# EAGLE design Main_Board_Kukang_EV (EAGLE 9.6.2)
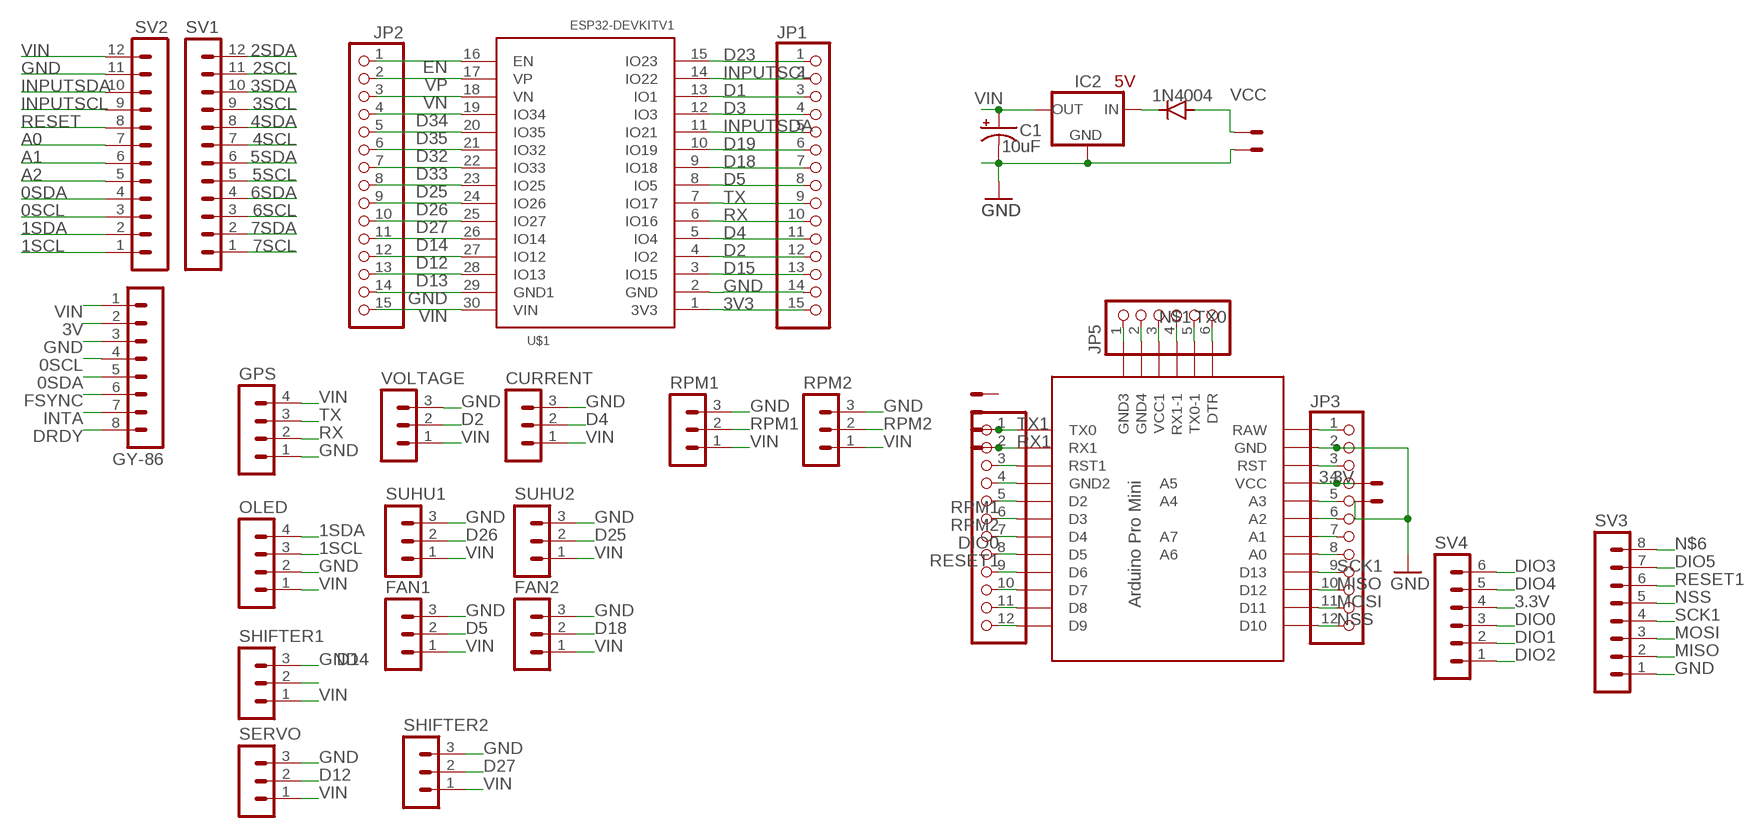
[diagram p0: schematic, sheet 1]

## Parts
C1  10uF  CPOL-USE5-10.5  [E5-10,5]
CURRENT  MA03-1  [MA03-1]
D1  1N4004  [DO41-10]
ESC_BOARD  22-23-2021  [22-23-2021]
FAN1  MA03-1  [MA03-1]
FAN2  MA03-1  [MA03-1]
GPS  MA04-1  [MA04-1]
GY-86  MA08-1  [MA08-1]
IC2  V_REG_78XX  [V78W_BACKWARDS]
JP1  PINHD-1X15  [1X15]
JP2  PINHD-1X15  [1X15]
JP3  PINHD-1X12  [1X12]
JP4  PINHD-1X12  [1X12]
JP5  PINHD-1X6  [1X06]
OLED  MA04-1  [MA04-1]
POWET  22-23-2021  [22-23-2021]
RPM1  MA03-1  [MA03-1]
RPM2  MA03-1  [MA03-1]
SERVO  MA03-1  [MA03-1]
SHIFTER1  MA03-1  [MA03-1]
SHIFTER2  MA03-1  [MA03-1]
SUHU1  MA03-1  [MA03-1]
SUHU2  MA03-1  [MA03-1]
SV1  MA12-1  [MA12-1]
SV2  MA12-1  [MA12-1]
SV3  MA08-1  [MA08-1]
SV4  MA06-1  [MA06-1]
U$1  ESP32DEVKITV1  [ESP32-DEVKITV1]
U$2  PRO-MINI-2  [PRO-MINI-2]
UART_MAIN_BOARD  22-23-2021  [22-23-2021]
VBAT  22-23-2021  [22-23-2021]
VOLTAGE  MA03-1  [MA03-1]

## Nets
0SCL: GY-86.4 SV2.3
0SDA: GY-86.5 SV2.4
1SCL: OLED.3 SV2.1
1SDA: OLED.4 SV2.2
2SCL: SV1.11
2SDA: SV1.12
3.3V: JP3.4 POWET.1 SV4.4 U$2.VCC
3SCL: SV1.9
3SDA: SV1.10
3V: GY-86.2
3V3: JP1.15 U$1.1(3V3)
4SCL: SV1.7
4SDA: SV1.8
5SCL: SV1.5
5SDA: SV1.6
6SCL: SV1.3
6SDA: SV1.4
7SCL: SV1.1
7SDA: SV1.2
A0: SV2.7
A1: SV2.6
A2: SV2.5
D1: JP1.3 U$1.13(IO1)
D2: JP1.12 U$1.4(IO2) VOLTAGE.2
D3: JP1.4 U$1.12(IO3)
D4: CURRENT.2 JP1.11 U$1.5(IO4)
D5: FAN1.2 JP1.8 U$1.8(IO5)
D12: JP2.12 SERVO.2 U$1.27(IO12)
D13: JP2.13 U$1.28(IO13)
D14: JP2.11 SHIFTER1.2 U$1.26(IO14)
D15: JP1.13 U$1.3(IO15)
D18: FAN2.2 JP1.7 U$1.9(IO18)
D19: JP1.6 U$1.10(IO19)
D23: JP1.1 U$1.15(IO23)
D25: JP2.8 SUHU2.2 U$1.23(IO25)
D26: JP2.9 SUHU1.2 U$1.24(IO26)
D27: JP2.10 SHIFTER2.2 U$1.25(IO27)
D32: JP2.6 U$1.21(IO32)
D33: JP2.7 U$1.22(IO33)
D34: JP2.4 U$1.19(IO34)
D35: JP2.5 U$1.20(IO35)
DIO0: JP4.7 SV4.3 U$2.D4
DIO1: JP4.9 SV4.2 U$2.D6
DIO2: SV4.1
DIO3: SV4.6
DIO4: SV4.5
DIO5: SV3.7
DRDY: GY-86.8
EN: JP2.1 U$1.16(EN)
FSYNC: GY-86.6
GND: C1.- CURRENT.3 FAN1.3 FAN2.3 GPS.1 GY-86.3 IC2.GND JP1.14 JP2.14 JP3.2 OLED.2 POWET.2 RPM1.3 RPM2.3 SERVO.3 SHIFTER1.3 SHIFTER2.3 SUHU1.3 SUHU2.3 SV2.11 SV3.1 U$1.2(GND) U$1.29(GND1) U$2.GND VBAT.2 VOLTAGE.3
INPUTSCL: JP1.2 SV2.9 U$1.14(IO22)
INPUTSDA: JP1.5 SV2.10 U$1.11(IO21)
INTA: GY-86.7
MISO: JP3.10 SV3.2 U$2.D12
MOSI: JP3.11 SV3.3 U$2.D11
N$1: JP5.3 U$2.VCC1
N$2: JP3.8 U$2.A0
N$3: JP3.7 U$2.A1
N$4: D1.C IC2.IN
N$5: JP3.6 U$2.A2
N$6: SV3.8
N$7: JP3.5 U$2.A3
N$8: JP3.3 U$2.RST
N$9: JP3.1 U$2.RAW
N$10: JP4.3 U$2.RST1
N$11: JP4.4 U$2.GND1(GND2)
N$14: JP4.10 U$2.D7
N$15: JP4.11 U$2.D8
N$16: JP4.12 U$2.D9
N$17: JP5.6 U$2.DTR
N$18: JP5.2 U$2.GND3(GND4)
N$19: JP5.1 U$2.GND2(GND3)
NSS: JP3.12 SV3.5 U$2.D10
RESET: SV2.8
RESET1: JP4.8 SV3.6 U$2.D5
RPM1: JP4.5 RPM1.2 U$2.D2
RPM2: JP4.6 RPM2.2 U$2.D3
RX: GPS.2 JP1.10 U$1.6(IO16)
RX0: JP5.4 U$2.RX1-1
RX1: JP4.2 U$2.RX1 UART_MAIN_BOARD.2
SCK1: JP3.9 SV3.4 U$2.D13
TX: GPS.3 JP1.9 U$1.7(IO17)
TX0: JP5.5 U$2.TX0-1
TX1: JP4.1 U$2.TX0 UART_MAIN_BOARD.1
VCC: D1.A VBAT.1
VIN: C1.+ CURRENT.1 FAN1.1 FAN2.1 GPS.4 GY-86.1 IC2.OUT JP2.15 OLED.1 RPM1.1 RPM2.1 SERVO.1 SHIFTER1.1 SHIFTER2.1 SUHU1.1 SUHU2.1 SV2.12 U$1.30(VIN) VOLTAGE.1
VN: JP2.3 U$1.18(VN)
VP: JP2.2 U$1.17(VP)
Unconnected: ESC_BOARD.1 ESC_BOARD.2 U$2.A4 U$2.A5 U$2.A6 U$2.A7

## Notes on the sheet
- 5V

## Library data of the parts
C1 = rcl:CPOL-US: POLARIZED CAPACITOR, American symbol; SPICEPREFIX: C
CURRENT FAN1 FAN2 RPM1 RPM2 SERVO SHIFTER1 SHIFTER2 SUHU1 SUHU2 VOLTAGE = con-lstb:MA03-1: PIN HEADER; OC_FARNELL: unknown; OC_NEWARK: unknown
D1 = diode:1N4004: DIODE general purpose rectifier, 1 A
ESC_BOARD POWET UART_MAIN_BOARD VBAT = con-molex:22-23-2021: .100" (2.54mm) Center Header - 2 Pin; MF: MOLEX; MPN: 22-23-2021; OC_FARNELL: 1462926; OC_NEWARK: 25C3832
GPS OLED = con-lstb:MA04-1: PIN HEADER; OC_FARNELL: unknown; OC_NEWARK: unknown
GY-86 SV3 = con-lstb:MA08-1: PIN HEADER; OC_FARNELL: unknown; OC_NEWARK: unknown
IC2 = 2018:V_REG_78XX: Voltage Regulator Standard 7805 5V regulator. IGO (Input Ground Output). Spark Fun Electronics SKU : COM-00107
JP1 JP2 = pinhead:PINHD-1X15: PIN HEADER
JP3 JP4 = pinhead:PINHD-1X12: PIN HEADER
JP5 = pinhead:PINHD-1X6: PIN HEADER
SV1 SV2 = con-lstb:MA12-1: PIN HEADER; OC_FARNELL: unknown; OC_NEWARK: unknown
SV4 = con-lstb:MA06-1: PIN HEADER; OC_FARNELL: unknown; OC_NEWARK: unknown
U$1 = ESP32-DEVKITV1:ESP32DEVKITV1
U$2 = Arduino-clone:PRO-MINI-2: Arduino Pro Mini Layout 2 Sparkfun.com

## Board
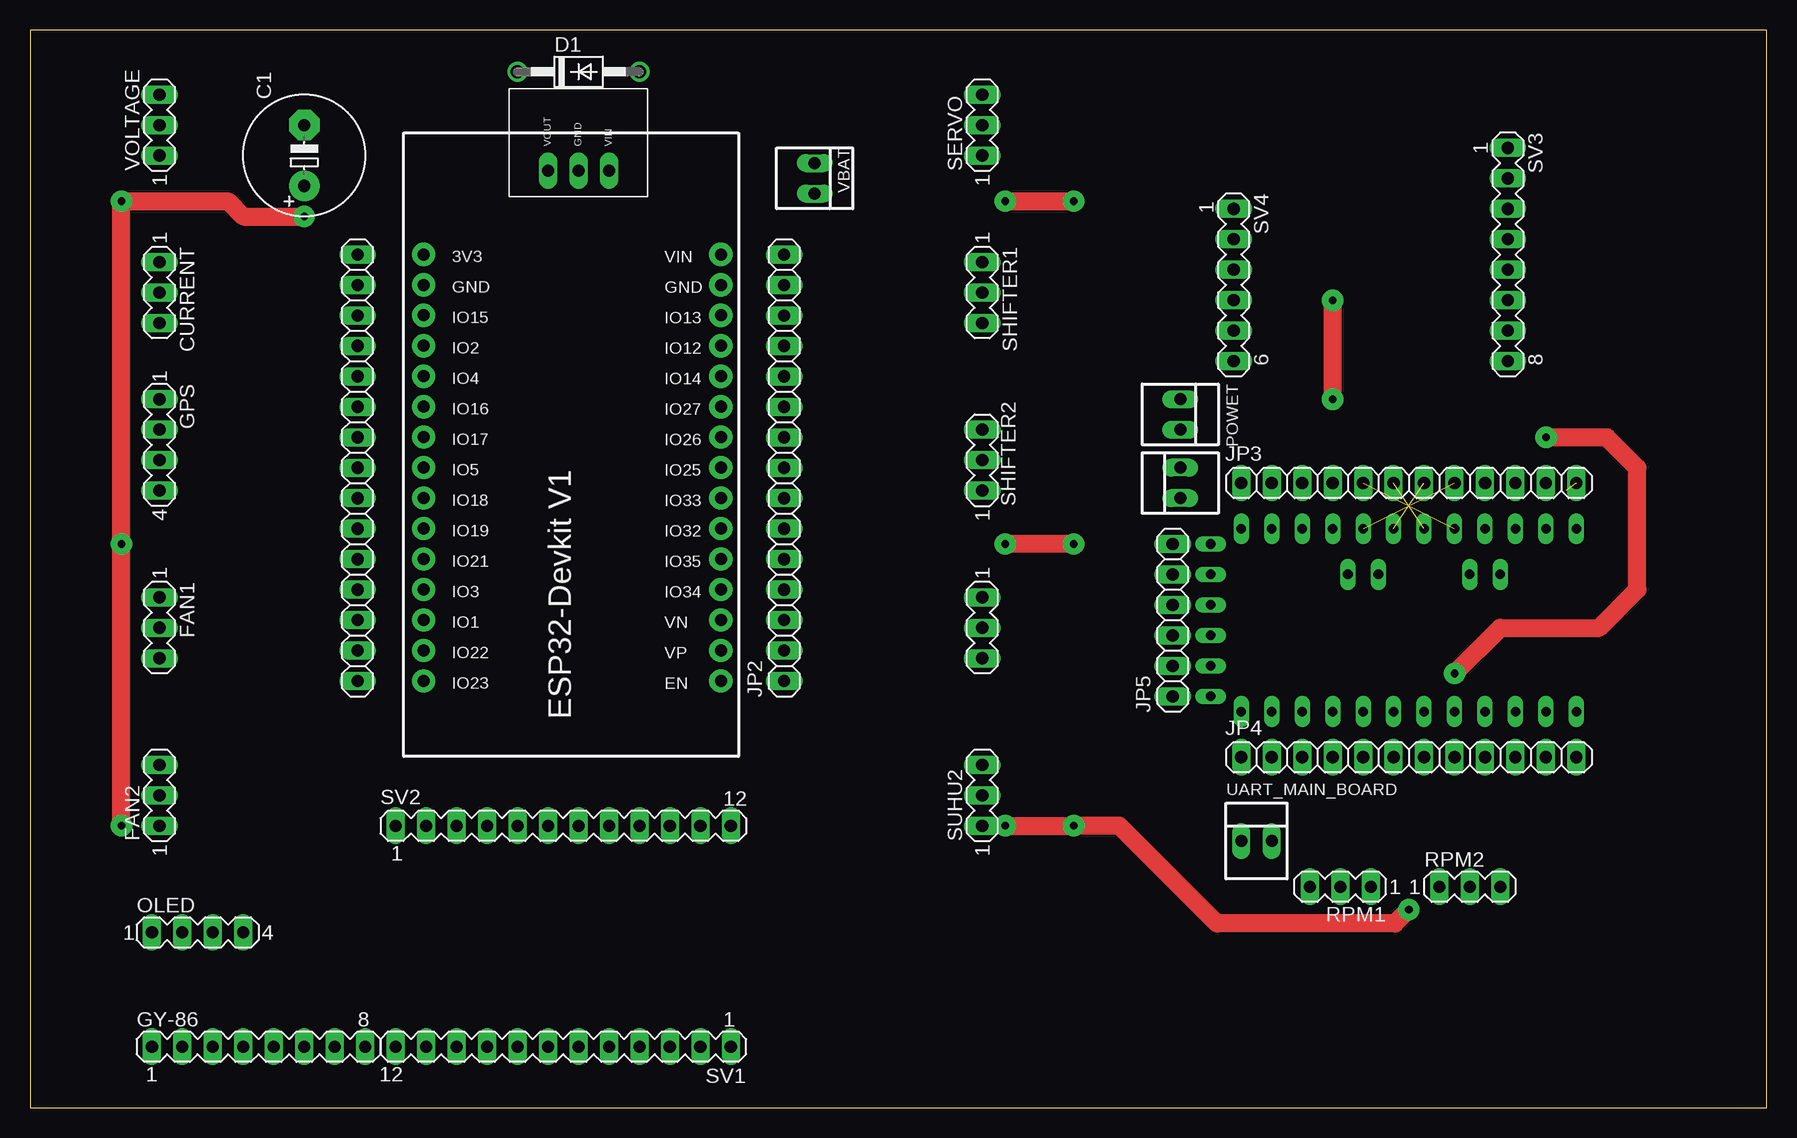
[diagram p1: board, top side]
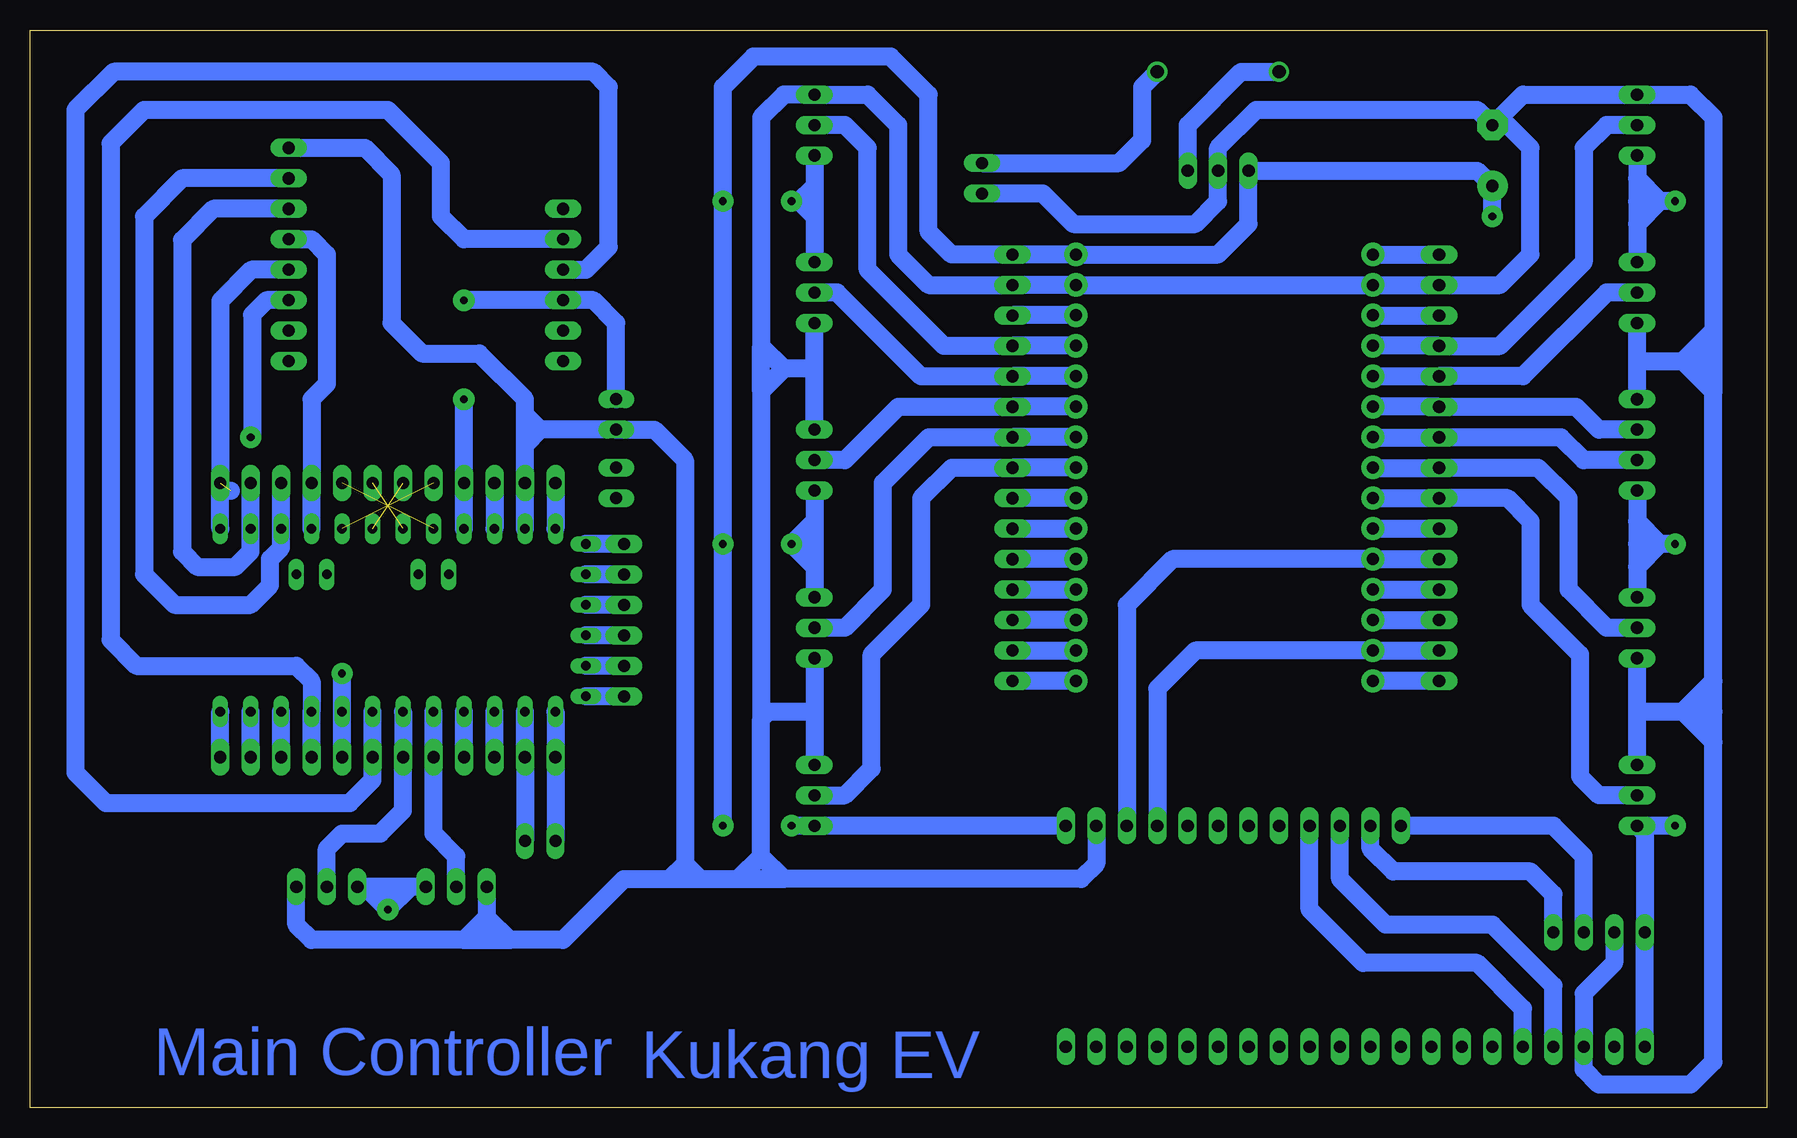
[diagram p2: board, bottom side, seen from below]

Size 144.76 x 89.84 mm. Coordinates in mm from the lower left corner, seen from the top.
Outline: 0,0 144.76,0 144.76,89.84 0,89.84 0,0
Copper layers (1*16): Top 0.035mm / dielectric 1.5mm / Bottom 0.035mm
Design rules "default": minimum track width 6mil, minimum drill 0.35mm, track to track 6mil, track to pad 6mil, pad to pad 6mil, via to via 6mil, smd to smd 6mil, copper to edge 40mil, drill to drill 6mil, minimum pad ring 10mil, minimum via ring 8mil, stop-mask expansion 4mil, vias tented up to drill 0mil, thermal gap 10mil

### Footprints (pad centres in the part's own frame; a part is rotated, then mirrored left to right if it is on the bottom)
E5-10,5 = drill 1.016 pad 2.54: + -2.54,0 | drill 1.016 pad 2.54 octagon: - 2.54,0
MA03-1 = drill 1.016 long: 1 -2.54,0; 2 0,0; 3 2.54,0
DO41-10 = drill 1.118: A 5.08,0; C -5.08,0
22-23-2021 = drill 1 long: 1 -1.27,0; 2 1.27,0
MA04-1 = drill 1.016 long: 1 -3.81,0; 2 -1.27,0; 3 1.27,0; 4 3.81,0
MA08-1 = drill 1.016 long: 1 -8.89,0; 2 -6.35,0; 3 -3.81,0; 4 -1.27,0; 5 1.27,0; 6 3.81,0; 7 6.35,0; 8 8.89,0
V78W_BACKWARDS = drill 1.016 long: GND 0,-3.81; IN 2.54,-3.81; OUT -2.54,-3.81
1X15 = drill 1.016 long: 1 -17.78,0; 2 -15.24,0; 3 -12.7,0; 4 -10.16,0; 5 -7.62,0; 6 -5.08,0; 7 -2.54,0; 8 0,0; 9 2.54,0; 10 5.08,0; 11 7.62,0; 12 10.16,0; 13 12.7,0; 14 15.24,0; 15 17.78,0
1X12 = drill 1.016 long: 1 -13.97,0; 2 -11.43,0; 3 -8.89,0; 4 -6.35,0; 5 -3.81,0; 6 -1.27,0; 7 1.27,0; 8 3.81,0; 9 6.35,0; 10 8.89,0; 11 11.43,0; 12 13.97,0
1X06 = drill 1.016 long: 1 -6.35,0; 2 -3.81,0; 3 -1.27,0; 4 1.27,0; 5 3.81,0; 6 6.35,0
MA12-1 = drill 1.016 long: 1 -13.97,0; 2 -11.43,0; 3 -8.89,0; 4 -6.35,0; 5 -3.81,0; 6 -1.27,0; 7 1.27,0; 8 3.81,0; 9 6.35,0; 10 8.89,0; 11 11.43,0; 12 13.97,0
MA06-1 = drill 1.016 long: 1 -6.35,0; 2 -3.81,0; 3 -1.27,0; 4 1.27,0; 5 3.81,0; 6 6.35,0
ESP32-DEVKITV1 = drill 1 pad 1.93: 1 -22.87,-13.54; 2 -20.33,-13.54; 3 -17.79,-13.54; 4 -15.25,-13.54; 5 -12.71,-13.54; 6 -10.17,-13.54; 7 -7.63,-13.54; 8 -5.09,-13.54; 9 -2.55,-13.54; 10 -0.01,-13.54; 11 2.53,-13.54; 12 5.07,-13.54; 13 7.61,-13.54; 14 10.15,-13.54; 15 12.69,-13.54; 16 12.69,11.23; 17 10.15,11.23; 18 7.61,11.23; 19 5.07,11.23; 20 2.53,11.23; 21 -0.01,11.23; 22 -2.55,11.23; 23 -5.09,11.23; 24 -7.63,11.23; 25 -10.17,11.23; 26 -12.71,11.23; 27 -15.25,11.23; 28 -17.79,11.23; 29 -20.33,11.23; 30 -22.87,11.23
PRO-MINI-2 = drill 0.8 long: A0 6.35,2.54; A1 6.35,0; A2 6.35,-2.54; A3 6.35,-5.08; A4 2.54,1.27; A5 2.54,3.81; A6 2.54,-8.89; A7 2.54,-6.35; D2 -8.89,2.54; D3 -8.89,0; D4 -8.89,-2.54; D5 -8.89,-5.08; D6 -8.89,-7.62; D7 -8.89,-10.16; D8 -8.89,-12.7; D9 -8.89,-15.24; D10 6.35,-15.24; D11 6.35,-12.7; D12 6.35,-10.16; D13 6.35,-7.62; DTR 5.08,15.24; GND 6.35,10.16; GND1 -8.89,5.08; GND2 -7.62,15.24; GND3 -5.08,15.24; RAW 6.35,12.7; RST 6.35,7.62; RST1 -8.89,7.62; RX1 -8.89,10.16; RX1-1 0,15.24; TX0 -8.89,12.7; TX0-1 2.54,15.24; VCC 6.35,5.08; VCC1 -2.54,15.24

### Placement (x,y rotation side)
C1  22.86,79.38 90 top
CURRENT  10.79,67.95 270 top
D1  45.72,86.36 0 top
ESC_BOARD  95.89,52.07 90 top
FAN1  10.79,40 270 top
FAN2  10.79,26.03 90 top
GPS  10.79,55.24 270 top
GY-86  19.05,5.08 0 top
IC2  45.72,81.92 0 top
JP1  27.3,53.34 90 top
JP2  62.87,53.34 90 top
JP3  114.94,52.07 0 top
JP4  114.94,29.21 0 top
JP5  95.25,40.64 90 top
OLED  13.97,14.6 0 top
POWET  95.89,57.79 270 top
RPM1  109.22,18.41 180 top
RPM2  120.02,18.41 0 top
SERVO  79.38,81.92 90 top
SHIFTER1  79.38,67.95 270 top
SHIFTER2  79.38,53.97 90 top
SUHU1  79.38,40 270 top
SUHU2  79.38,26.03 90 top
SV1  44.45,5.08 180 top
SV2  44.45,23.49 0 top
SV3  123.19,71.12 270 top
SV4  100.33,68.58 270 top
U$1  46.35,48.26 270 top
U$2  113.67,41.91 90 top
UART_MAIN_BOARD  102.23,22.23 0 top
VBAT  65.41,77.47 270 top
VOLTAGE  10.79,81.92 90 top

### Tracks (layer width: path | path; a pad name or v marks a point on that pad's centre or on a via)
0SCL
  Bottom 1.5: GY-86.4 17.78,10.16 22.86,15.24 31.75,15.24 35.56,19.05 SV2.3
0SDA
  Bottom 1.5: GY-86.5 20.32,8.26 24.13,12.06 33.66,12.06 38.1,16.51 SV2.4
1SCL
  Bottom 1.5: OLED.3 15.24,20.95 17.78,23.49 SV2.1
1SDA
  Bottom 1.5: OLED.4 17.78,17.78 19.68,19.69 31.11,19.69 33.02,21.59 SV2.2
3.3V  (via drill 0.64 pad 1.78)
  Top 1.5: v108.58,59.05 v108.58,67.31
  Bottom 1.5: U$2.VCC JP3.4 v108.58,59.05 | v108.58,67.31 SV4.4 97.79,67.31 95.89,65.41 POWET.1
3V3
  Bottom 1.5: U$1.1 32.8,71.12 JP1.15
D1
  Bottom 1.5: U$1.13 32.8,40.64 JP1.3
D2
  Bottom 1.5: U$1.4 27.32,63.51 JP1.12 22.23,63.5 15.24,70.48 15.24,80.01 13.34,81.92 VOLTAGE.2
D3
  Bottom 1.5: U$1.12 32.8,43.18 JP1.4
D4
  Bottom 1.5: U$1.5 27.32,60.97 | 27.32,60.97 JP1.11 | CURRENT.2 13.34,67.95 20.31,60.97 27.32,60.97
D5
  Bottom 1.5: U$1.8 32.8,53.34 JP1.8 19.05,53.34 16.51,50.8 16.51,43.18 13.34,40 FAN1.2
D12
  Bottom 1.5: U$1.27 62.85,63.51 JP2.12 68.58,63.5 74.93,69.85 74.93,80.01 76.83,81.92 SERVO.2
D13
  Bottom 1.5: U$1.28 62.85,66.05 JP2.13
D14
  Bottom 1.5: U$1.26 62.85,60.97 JP2.11 70.48,60.96 77.47,67.95 SHIFTER1.2
D15
  Bottom 1.5: U$1.3 32.8,66.04 JP1.13
D18
  Bottom 1.5: U$1.9 JP1.7 21.59,50.8 19.68,48.89 19.68,41.91 15.56,37.78 15.56,27.62 13.97,26.03 FAN2.2
D19
  Bottom 1.5: U$1.10 JP1.6
D23
  Bottom 1.5: JP1.1 32.8,35.56 U$1.15
D25
  Bottom 1.5: U$1.23 62.85,53.35 JP2.8 67.94,53.34 70.48,50.8 70.48,41.91 74.61,37.78 74.61,28.26 76.83,26.03 SUHU2.2
D26
  Bottom 1.5: U$1.24 62.85,55.89 JP2.9 69.85,55.88 73.66,52.07 73.66,43.18 76.83,40 SUHU1.2
D27
  Bottom 1.5: U$1.25 62.85,58.43 JP2.10 72.39,58.42 76.83,53.97 SHIFTER2.2
D32
  Bottom 1.5: JP2.6 57.59,48.26 U$1.21
D33
  Bottom 1.5: U$1.22 62.85,50.81 JP2.7
D34
  Bottom 1.5: JP2.4 57.59,43.18 U$1.19
D35
  Bottom 1.5: U$1.20 62.85,45.73 JP2.5
DIO0
  Bottom 1.5: U$2.D4 JP4.7 116.2,27.3 118.11,25.4 138.43,25.4 140.97,27.94 140.97,83.19 137.79,86.36 97.79,86.36 96.52,85.09 96.52,71.76 98.42,69.85 SV4.3
DIO1
  Bottom 1.5: JP4.9 U$2.D6 121.28,35.56 122.56,36.83 135.89,36.83 138.05,38.99 138.05,80.39 135.25,83.19 114.94,83.19 110.49,78.74 110.49,74.3 108.58,72.39 SV4.2
EN
  Bottom 1.5: U$1.16 62.85,35.57 JP2.1
GND
  Bottom 1.5: 62.85,68.59 U$1.29 U$1.2 | 62.85,68.59 JP2.14 | U$1.2 | U$1.2 JP1.14 22.23,68.58 19.68,71.12 19.68,80.01 21.59,81.92 C1.- | GPS.1 10.79,62.23 | 10.79,62.23 CURRENT.3 | FAN2.3 10.79,33.02 | 10.79,33.02 FAN1.3 | SHIFTER2.3 79.38,61.59 | 79.38,61.59 SHIFTER1.3 | SUHU1.3 79.38,33.02 | 79.38,33.02 SUHU2.3 | SV2.11 55.88,20.32 57.15,19.05 81.92,19.05 | 81.92,19.05 83.82,20.95 | 83.82,20.95 83.82,32.38 | 83.82,32.38 83.19,33.02 79.38,33.02 | OLED.2 12.7,12.06 15.24,9.53 GY-86.3 15.24,3.17 13.97,1.9 6.35,1.9 4.45,3.81 4.45,30.48 | VBAT.2 60.33,76.2 57.78,73.66 47.62,73.66 45.72,75.56 IC2.GND 45.72,80.01 42.55,83.19 24.13,83.19 C1.- | C1.- 20.32,84.45 VOLTAGE.3 6.35,84.45 4.45,82.55 4.45,64.77 | 62.85,68.59 69.86,68.59 72.39,71.12 72.39,81.92 74.93,84.45 SERVO.3 81.92,84.45 83.82,82.55 83.82,63.5 | 79.38,61.59 81.92,61.59 | 81.92,61.59 83.82,59.69 | 83.82,59.69 83.82,32.38 | 10.79,33.02 6.99,33.02 | 4.45,35.56 4.45,59.69 | 4.45,59.69 6.99,62.23 | 4.45,35.56 6.99,33.02 | 10.79,62.23 6.99,62.23 | 4.45,64.77 4.45,62.23 | 4.45,62.23 4.45,59.69 | 4.45,30.48 4.45,33.02 | 4.45,33.02 4.45,35.56 | 6.99,33.02 4.45,30.48 | 6.99,33.02 4.45,33.02 | 6.99,62.23 4.45,64.77 | 6.99,62.23 4.45,62.23 | 83.82,63.5 81.92,61.59 | 83.82,59.69 83.82,63.5 | U$2.GND JP3.2 103.5,55.24 | SV3.1 116.84,80.01 114.62,77.79 114.62,65.41 112.08,62.87 107.31,62.87 103.5,59.05 103.5,57.79 | 103.5,55.24 103.5,56.51 | 103.5,56.51 103.5,57.79 | 102.23,56.51 POWET.2 92.71,56.51 90.17,53.97 90.17,20.32 | 102.23,56.51 103.5,56.51 | 102.23,56.51 103.5,55.24 | 102.23,56.51 103.5,57.79 | RPM1.3 106.68,15.87 | 108.58,13.97 106.68,15.87 | 108.58,13.97 121.28,13.97 122.56,15.24 RPM2.3
  Bottom 1.5: 90.17,20.32 88.9,19.05 | 88.9,19.05 85.72,19.05 | 85.72,19.05 81.92,19.05 | 108.58,13.97 106.68,13.97 | 106.68,13.97 104.78,13.97 | 104.78,13.97 100.33,13.97 95.25,19.05 91.44,19.05 | 91.44,19.05 88.9,19.05 | 90.17,20.32 91.44,19.05 | 83.82,20.95 85.72,19.05 | 106.68,15.87 104.78,13.97 | 106.68,15.87 106.68,13.97
INPUTSCL
  Bottom 1.5: JP1.2 32.8,38.1 U$1.14 47.62,38.11 50.8,34.92 SV2.9
INPUTSDA
  Bottom 1.5: JP1.5 U$1.11 49.52,45.73 53.34,41.91 SV2.10
MISO
  Bottom 1.5: JP3.10 U$2.D12 123.83,46.67 124.75,45.75 124.75,43.53 126.36,41.91 132.72,41.91 135.25,44.45 135.25,74.3 132.08,77.47 SV3.2
MOSI
  Bottom 1.5: JP3.11 U$2.D11 126.36,46.35 127.64,45.09 130.81,45.09 132.08,46.35 132.08,72.33 129.48,74.93 SV3.3
N$1
  Bottom 1.5: JP5.3 U$2.VCC1
N$2  (1 unrouted)
N$3  (1 unrouted)
N$4
  Bottom 1.5: IC2.IN 48.26,81.92 43.81,86.36 D1.C
N$5  (1 unrouted)
N$7  (1 unrouted)
N$8
  Bottom 1.5: JP3.3 U$2.RST
N$9
  Bottom 1.5: JP3.1 U$2.RAW
N$10
  Bottom 1.5: JP4.3 U$2.RST1
N$11
  Bottom 1.5: JP4.4 U$2.GND1
N$14
  Bottom 1.5: JP4.10 U$2.D7
N$15
  Bottom 1.5: JP4.11 U$2.D8
N$16
  Bottom 1.5: JP4.12 U$2.D9
N$17
  Bottom 1.5: JP5.6 U$2.DTR
N$18
  Bottom 1.5: JP5.2 U$2.GND3
N$19
  Bottom 1.5: JP5.1 U$2.GND2
NSS  (1 unrouted)
  Bottom 1.5: U$2.D10 JP3.12 | SV3.5 126.31,69.85 128.91,67.25 128.91,51.43 128.03,51.43
RESET1  (via drill 0.64 pad 1.78)
  Top 1.5: v118.75,36.2 122.56,40 130.81,40 133.99,43.18 133.99,53.34 131.44,55.88 v126.36,55.88
  Bottom 1.5: JP4.8 U$2.D5 v118.75,36.2 | SV3.6 125.04,67.31 126.25,66.09 126.25,55.99 v126.36,55.88
RPM1
  Bottom 1.5: U$2.D2 JP4.5 111.12,22.86 109.22,20.95 RPM1.2
RPM2
  Bottom 1.5: U$2.D3 JP4.6 113.67,24.77 115.57,22.86 118.75,22.86 120.02,21.59 RPM2.2
RX
  Bottom 1.5: U$1.6 27.32,58.43 JP1.10 15.88,58.42 13.97,56.51 GPS.2
RX0
  Bottom 1.5: JP5.4 U$2.RX1-1
RX1
  Bottom 1.5: U$2.RX1 JP4.2 UART_MAIN_BOARD.2
SCK1
  Bottom 1.5: U$2.D13 JP3.9 121.28,59.05 120.02,60.32 120.02,71.12 121.28,72.39 SV3.4
TX
  Bottom 1.5: U$1.7 JP1.9 17.14,55.88 15.24,53.97 GPS.3
TX0
  Bottom 1.5: JP5.5 U$2.TX0-1
TX1
  Bottom 1.5: U$2.TX0 JP4.1 UART_MAIN_BOARD.1
VCC
  Bottom 1.5: D1.A 52.07,85.09 52.07,80.65 53.98,78.74 VBAT.1
VIN  (via drill 0.64 pad 1.78)
  Top 1.5: v87,46.99 v81.28,46.99 | v81.28,23.49 v87,23.49 90.81,23.49 98.95,15.35 113.78,15.35 v114.94,16.51 | v7.62,23.49 v7.62,46.99 v7.62,75.56 16.51,75.56 17.78,74.3 v22.86,74.3 | v81.28,75.56 v87,75.56
  Bottom 1.5: VOLTAGE.1 10.79,77.47 | 10.79,77.47 10.79,75.56 | 10.79,75.56 10.79,73.66 | 10.79,73.66 CURRENT.1 | GPS.4 10.79,48.89 | 10.79,48.89 10.79,46.99 | 10.79,46.99 10.79,45.09 | 10.79,45.09 FAN1.1 | SERVO.1 79.38,76.84 | 79.38,76.84 79.38,75.56 | 79.38,75.56 79.38,74.3 | 79.38,74.3 SHIFTER1.1 | SV2.12 SUHU2.1 v81.28,23.49 | GY-86.1 OLED.1 10.16,22.86 FAN2.1 v7.62,23.49 | SHIFTER2.1 79.38,48.89 | 79.38,48.89 79.38,46.99 | 79.38,46.99 79.38,45.09 | 79.38,45.09 SUHU1.1 | v81.28,46.99 79.38,46.99 | v81.28,46.99 79.38,48.89 | v81.28,46.99 79.38,45.09 | v87,23.49 v87,46.99 v87,75.56 87,85.09 84.45,87.63 73.03,87.63 69.85,84.45 69.85,73.03 67.94,71.12 JP2.15 62.85,71.13 U$1.30 57.58,71.12 45.72,71.12 43.18,73.66 IC2.OUT 24.13,78.11 C1.+ v22.86,74.3 | v7.62,75.56 8.89,75.56 | 10.79,75.56 8.89,75.56 | 8.89,75.56 10.79,73.66 | 8.89,75.56 10.79,77.47 | v7.62,46.99 8.89,46.99 | 10.79,46.99 8.89,46.99 | 8.89,46.99 10.79,48.89 | 8.89,46.99 10.79,45.09 | 79.38,75.56 v81.28,75.56 80.64,75.56 | 80.64,75.56 79.38,76.84 | 80.64,75.56 79.38,74.3 | RPM1.1 113.03,18.41 | 113.03,18.41 114.94,18.41 | 114.94,18.41 116.84,18.41 | 116.84,18.41 RPM2.1 | v114.94,16.51 114.94,18.41 | v114.94,16.51 116.84,18.41 | v114.94,16.51 113.03,18.41
VN
  Bottom 1.5: U$1.18 62.85,40.65 JP2.3
VP
  Bottom 1.5: U$1.17 57.59,38.1 JP2.2

### Text on the board
Bottom: Kukang EV | Main Controller